# EAGLE design reg_neg (EAGLE 5.06)
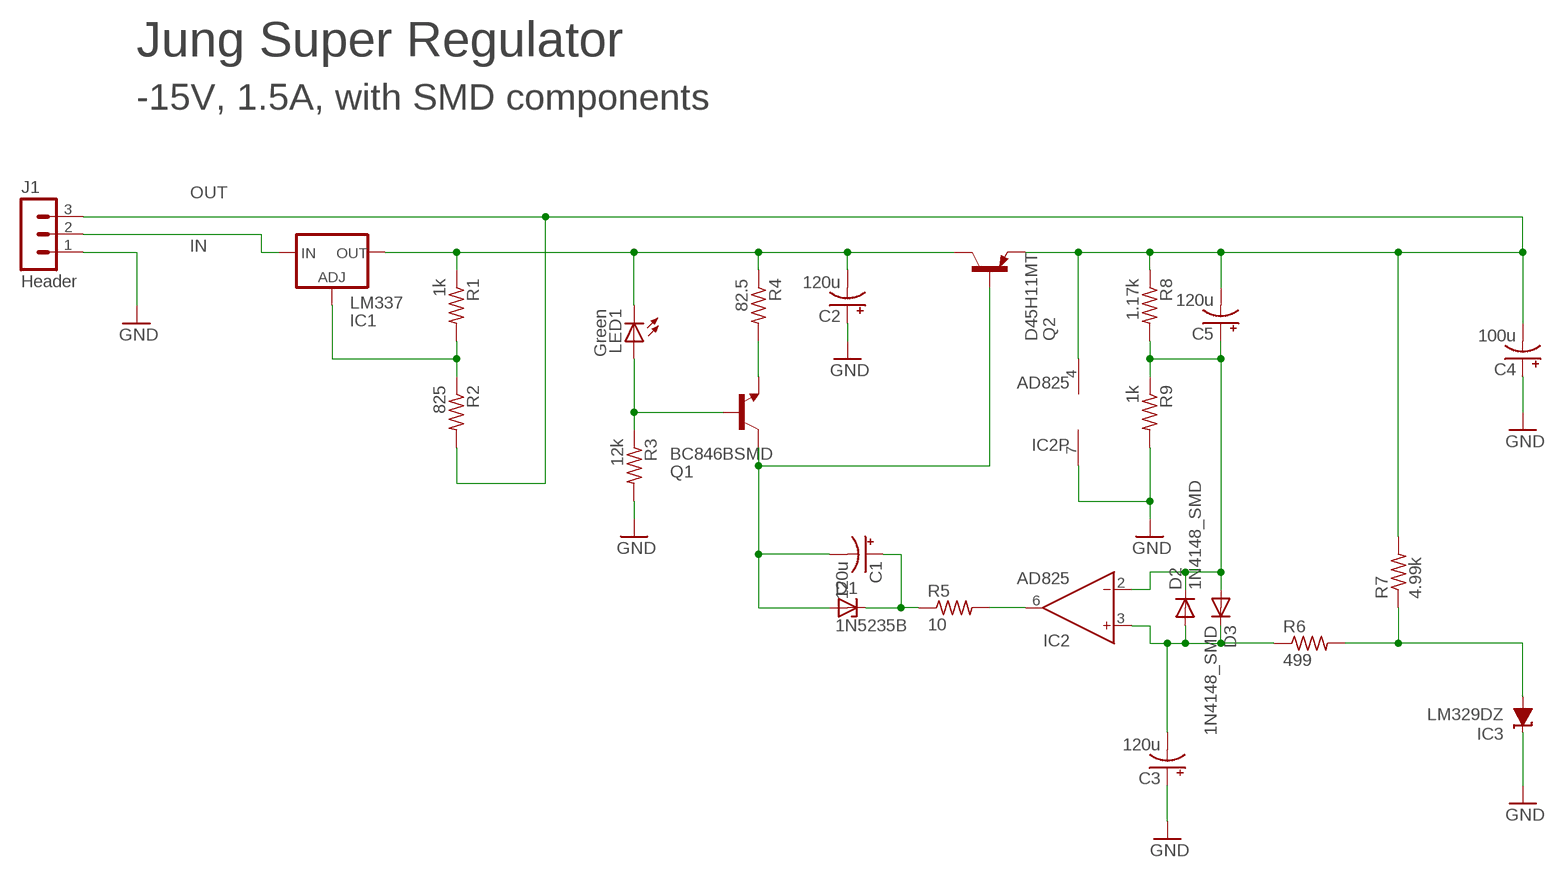
[diagram p0: schematic, sheet 1]

## Parts
C1  120u  CPOL-USE2.5-5  [E2,5-5]
C2  120u  CPOL-USE2.5-5  [E2,5-5]
C3  120u  CPOL-USE2.5-5  [E2,5-5]
C4  100u  CPOL-USC  [PANASONIC_C]
C5  120u  CPOL-USE2.5-5  [E2,5-5]
D1  1N5235B  ZENER-DIODEDO34-7  [DO34Z7]
D2  1N4148_SMD  [SOD123]
D3  1N4148_SMD  [SOD123]
IC1  LM337  LM337LD2  [D2PACK]
IC2  AD825  AD811_SO8  [SO8]
IC3  LM329DZ  [TO92-LINE]
J1  Header  MA03-1  [MA03-1]
LED1  Green  LEDCHIPLED_1206  [CHIPLED_1206]
Q1  BC846BSMD  [SOT23]
Q2  D45H11MT  [DPAK]
R1  1k  R-US_R1206  [R1206]
R2  825  R-US_R1206  [R1206]
R3  12k  R-US_R1206  [R1206]
R4  82.5  R-US_R1206  [R1206]
R5  10  R-US_R1206  [R1206]
R6  499  R-US_R1206  [R1206]
R7  4.99k  R-US_R1206  [R1206]
R8  1.17k  R-US_R1206  [R1206]
R9  1k  R-US_R1206  [R1206]

## Nets
BASE: C1.- D1.A Q1.3(C) Q2.1(B)
GND: C2.+ C3.+ C4.+ IC2.7(V+) IC3.2(C) J1.1 R3.2 R9.2
IN: IC1.2(IN) J1.2
N$2: IC1.1(ADJ) R1.2 R2.1
N$3: C3.- D2.A D3.C IC2.3(IN+) R6.1
N$5: C5.+ D2.C D3.A IC2.2(IN-) R8.2 R9.1
N$6: IC3.3(A) R6.2 R7.1
N$7: IC2.6(OUT) R5.2
N$8: LED1.A Q1.1(B) R3.1
N$9: Q1.2(E) R4.2
N$11: C1.+ D1.C R5.1
OUT: C4.- C5.- IC2.4(V-) J1.3 Q2.3(E) R2.2 R7.2 R8.1
PREOUT: C2.- IC1.3(OUT) LED1.C Q2.2(C) R1.1 R4.1
Unconnected: IC2.1(NC) IC2.5(NC) IC2.8(NC)

## Notes on the sheet
- Jung Super Regulator
- -15V, 1.5A, with SMD components

## Library data of the parts
C1-C5 = rcl:CPOL-US: POLARIZED CAPACITOR, American symbol
D1 = diode:ZENER-DIODE: Z-Diode
D2 D3 = smps:1N4148_SMD: Tiny version 1N4148 switching diode 75V, 150mA, SOD-123 package Digikey part number 1N4148WDICT-ND
IC1 = cdp:LM337L: VOLTAGE REGULATOR
IC2 = analog-devices:AD811_SO8: ANALOG DEVICES
IC3 = cdp:LM329DZ
J1 = con-lstb:MA03-1: PIN HEADER
LED1 = led:LED: LED OSRAM: - CHIPLED LG R971, LG N971, LY N971, LG Q971, LY Q971, LO R971, LY R971 LH N974, LH R974 LS Q976, LO Q976, LY Q976 LO Q996 - Hyper CHIPLED LW Q18S LB Q993, LB Q99A, LB R99A - SideLED LS A670, LO A670, LY A670, LG A670, LP A670 LB A673, LV A673, LT A673, LW A673 LH A674 LY A675 LS A676, LA A676, LO A676, LY A676, LW A676 LS A679, LY A679, LG A679 - Hyper Micro SIDELED® LS Y876, LA Y876, LO Y876, LY Y876 LT Y87S - SmartLED LW L88C, LW L88S LB L89C, LB L89S, LG L890 LS L89K, LO L89K, LY L89K LS L896, LA L896, LO L896, LY L896 - TOPLED LS T670, LO T670, LY T670, LG T670, LP T670 LSG T670, LSP T670, LSY T670, LOP T670, LYG T670 LG T671, LOG T671, LSG T671 LB T673, LV T673, LT T673, LW T673 LH T674 LS T676, LA T676, LO T676, LY T676, LB T676, LH T676, LSB T676, LW T676 LB T67C, LV T67C, LT T67C, LS T67K, LO T67K, LY T67K, LW E67C LS E67B, LA E67B, LO E67B, LY E67B, LB E67C, LV E67C, LT E67C LW T67C LS T679, LY T679, LG T679 LS T770, LO T770, LY T770, LG T770, LP T770 LB T773, LV T773, LT T773, LW T773 LH T774 LS E675, LA E675, LY E675, LS T675 LS T776, LA T776, LO T776, LY T776, LB T776 LHGB T686 LT T68C, LB T68C - Hyper Mini TOPLED® LB M676 - Mini TOPLED Santana® LG M470 LS M47K, LO M47K, LY M47K Source: http://www.osram.convergy.de LUXEON: - LUMILED® LXK2-PW12-R00, LXK2-PW12-S00, LXK2-PW14-U00, LXK2-PW14-V00 LXK2-PM12-R00, LXK2-PM12-S00, LXK2-PM14-U00 LXK2-PE12-Q00, LXK2-PE12-R00, LXK2-PE12-S00, LXK2-PE14-T00, LXK2-PE14-U00 LXK2-PB12-K00, LXK2-PB12-L00, LXK2-PB12-M00, LXK2-PB14-N00, LXK2-PB14-P00, LXK2-PB14-Q00 LXK2-PR12-L00, LXK2-PR12-M00, LXK2-PR14-Q00, LXK2-PR14-R00 LXK2-PD12-Q00, LXK2-PD12-R00, LXK2-PD12-S00 LXK2-PH12-R00, LXK2-PH12-S00 LXK2-PL12-P00, LXK2-PL12-Q00, LXK2-PL12-R00 Source: www.luxeon.com KINGBRIGHT: KA-3528ASYC Source: www.kingbright.com
Q1 = transistor-npn:BC846*: NPN Transistor
Q2 = cdp:D45H11
R1-R9 = rcl:R-US_: RESISTOR, American symbol

## Board
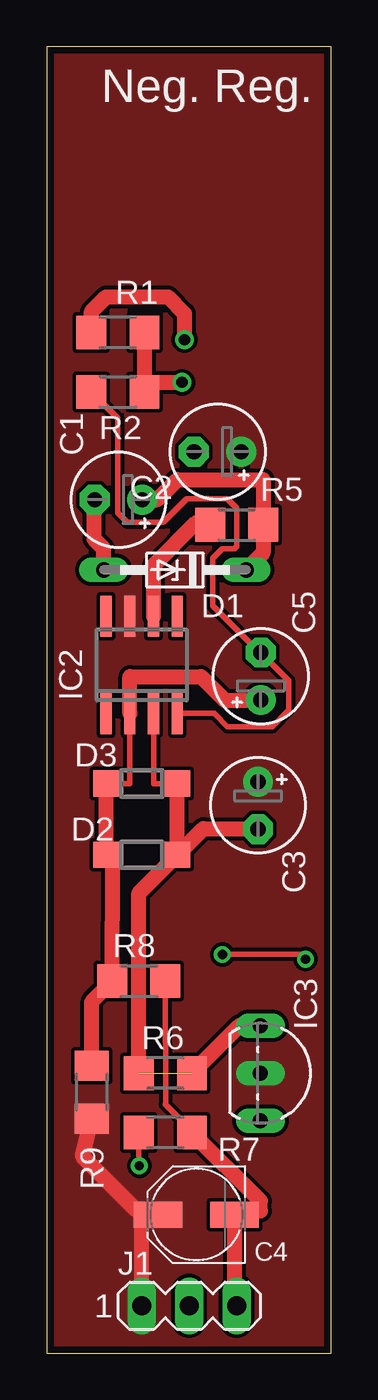
[diagram p1: board, top side]
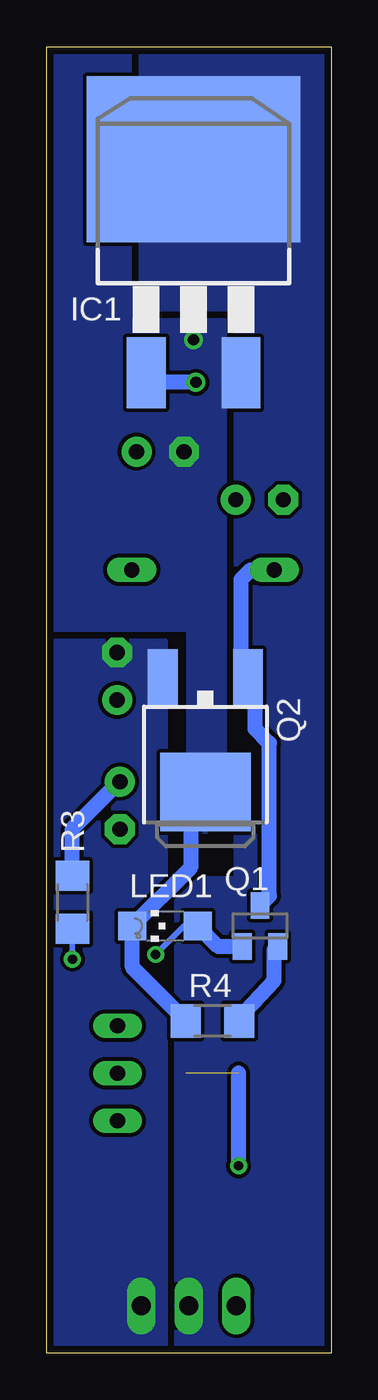
[diagram p2: board, bottom side, seen from below]

Size 15.22 x 69.9 mm. Coordinates in mm from the lower left corner, seen from the top.
Outline: 0,0 15.22,0 15.22,69.9 0,69.9 0,0
Copper layers (1*16): Top 0.035mm / dielectric 1.5mm / Bottom 0.035mm
Design rules "8mils *": minimum track width 10mil, minimum drill 15mil, track to track 8mil, track to pad 8mil, pad to pad 8mil, via to via 8mil, smd to smd 8mil, copper to edge 15mil, drill to drill 8mil, minimum pad ring 10mil, minimum via ring 8mil, stop-mask expansion 4mil, vias tented up to drill 0mil, thermal gap 0mil

### Footprints (pad centres in the part's own frame; a part is rotated, then mirrored left to right if it is on the bottom)
E2,5-5 = drill 0.813 pad 1.6 round: + -1.27,0 | drill 0.813 pad 1.6 octagon: - 1.27,0
PANASONIC_C = smd 2.6 x 1.4: + 2.05,0; - -2.05,0
DO34Z7 = drill 0.813 long: A 3.81,0; C -3.81,0
SOD123 = smd 1.4 x 1.4: A 1.9,0; C -1.9,0
D2PACK = smd 2.083 x 3.81: 1 -2.54,-8.89; 3 2.54,-8.89 | smd 11.43 x 8.89: 2 0,2.54
SO8 = smd 0.6 x 2.2: 1 -1.905,-2.6; 2 -0.635,-2.6; 3 0.635,-2.6; 4 1.905,-2.6; 5 1.905,2.6; 6 0.635,2.6; 7 -0.635,2.6; 8 -1.905,2.6
TO92-LINE = drill 0.813 long: 1 2.54,0; 2 0,0; 3 -2.54,0
MA03-1 = drill 1.016 long: 1 -2.54,0; 2 0,0; 3 2.54,0
CHIPLED_1206 = smd 1.5 x 1.5: A 0,-1.75; C 0,1.75
SOT23 = smd 1 x 1.4: 1 -0.95,-1.1; 2 0.95,-1.1; 3 0,1.1
DPAK = smd 1.6 x 3: 1 -2.28,-4.04; 3 2.28,-4.04 | smd 4.826 x 4.191: 2 0,2.096
R1206 = smd 1.6 x 1.803: 1 -1.422,0; 2 1.422,0

### Placement (x,y rotation side)
C1  3.84,45.67 180 top
C2  9.14,48.23 180 top
C3  11.3,29.31 270 top
C4  8,7.42 180 top
C5  11.46,36.22 90 top
D1  6.86,41.91 180 top
D2  5.08,26.67 0 top
D3  5.08,30.48 180 top
IC1  7.37,61.34 0 bottom
IC2  5.08,36.83 0 top
IC3  11.43,14.99 270 top
J1  7.62,2.54 0 top
LED1  8.89,22.86 90 bottom
Q1  3.81,22.86 0 bottom
Q2  6.73,32.13 180 bottom
R1  3.81,54.61 0 top
R2  3.81,51.44 180 top
R3  13.84,24.13 90 bottom
R4  6.35,17.78 0 bottom
R5  10.16,44.32 180 top
R6  6.35,14.99 0 top
R7  6.35,11.81 0 top
R8  4.93,19.91 180 top
R9  2.41,13.97 270 top

### Tracks (layer width: path | path; a pad name or v marks a point on that pad's centre or on a via)
BASE
  Top 0.813: D1.A 3.05,43.05 2.54,43.56 2.54,45.64 C1.-
  Bottom 0.813: 4.06,35.69 4.07,35.69 | 4.06,35.69 4.06,33.4 3.3,32.64 3.3,24.47 Q1.3 | 4.06,35.69 4.06,36.17 Q2.1 4.45,36.55 4.83,36.55 4.83,41.4 4.32,41.91 D1.A
GND
  Top 0.813: R9.2 1.91,10.54 4.83,7.62 5.71,7.62 | C4.+ 5.71,7.42 5.71,7.62 | J1.1 5.08,7.62 5.71,7.62
  Bottom 0.813: R3.2 13.84,28.07 11.33,30.58 C3.+
  pour Top: 0.25,69.6 15.11,69.6 15.11,0.13 0.25,0.13
IN
  pour Bottom: 8.26,0 8.26,25.4 5.08,25.4 5.08,29.84 5.08,55.88 10.16,55.88 10.16,69.85 0,69.85 0,0
N$2  (via drill 0.6)
  Top 0.813: R1.2 R2.1 5.74,51.94 v7.24,51.94
  Bottom 0.813: v7.24,51.94 9.4,51.94 IC1.1
N$3
  Top 0.305: D3.C 5.71,30.48 IC2.3
  Top 0.813: D2.A D3.C | R6.1 4.93,24.62 D2.A | D2.A 8.38,28.07 11.3,28.07 C3.-
N$5
  Top 0.305: D3.A 4.45,30.48 IC2.2 | R9.1 2.41,15.62
  Top 0.813: D3.A D2.C 3.53,26.32 R8.2 2.41,18.82 2.41,15.62 | IC2.2 4.45,36.2 8.26,36.2 9.53,34.92 9.55,34.95 C5.+
N$6  (via drill 0.5)  (1 unrouted)
  Top 0.305: 4.93,12.14 4.93,10.06 v4.95,10.03
  Top 0.406: 4.93,12.14 R7.1
  Top 0.813: IC3.3 10.31,17.53 R6.2
  Bottom 0.813: v4.95,10.03 4.95,14.99
N$7
  Top 0.813: R5.2 8,44.45 5.71,42.16 IC2.6
N$8  (via drill 0.5)
  Top 0.305: v9.4,21.34 13.59,21.34 v13.84,21.08
  Bottom 0.305: v9.4,21.34 7.87,22.86 LED1.A | v13.84,21.08 R3.1
  Bottom 0.813: Q1.1 6.04,21.76 LED1.A
N$9
  Bottom 0.813: R4.2 4.93,17.93 3.05,19.94 3.05,21.57 Q1.2
N$11
  Top 0.813: D1.C 11.58,42.82 R5.1 11.58,46.74 6.99,46.74 5.92,45.67 C1.+
OUT
  Top 0.305: R7.2 7.77,11.91 6.35,13.34 6.38,13.36 R8.1 | IC2.4 8.95,34.23 9.65,33.53 12.06,33.53 12.95,34.42 12.95,35.99 C5.- 11.4,37.49 8.89,40.01 8.89,42.55 9.4,43.05 10.03,43.05 10.16,43.18 10.16,45.21 9.65,45.72 7.49,45.72 6.22,44.45 4.32,44.45 3.81,44.96 3.81,50.01 R2.2
  Top 0.813: R7.2 11.43,8.15 11.43,7.62 10.05,7.62 C4.- 10.05,2.54 J1.3
  pour Bottom: 15.24,0 15.24,38.1 8.89,38.1 8.89,0
PREOUT  (via drill 0.6)
  Top 0.813: R1.1 2.39,55.73 3.17,56.52 6.48,56.52 7.37,55.63 v7.37,54.23
  Bottom 0.813: R4.1 10.64,20.65 LED1.C 7.63,25.87 7.59,25.87 7.49,26.04 7.49,30.04 Q2.2
  pour Bottom: 10.79,69.85 15.24,69.85 15.24,38.73 7.62,38.73 7.62,27.94 5.71,27.94 5.71,55.24 10.79,55.24

### Text on the board
tPlace: Neg. Reg.